# Altium project PCB_Project_2.PrjPcb
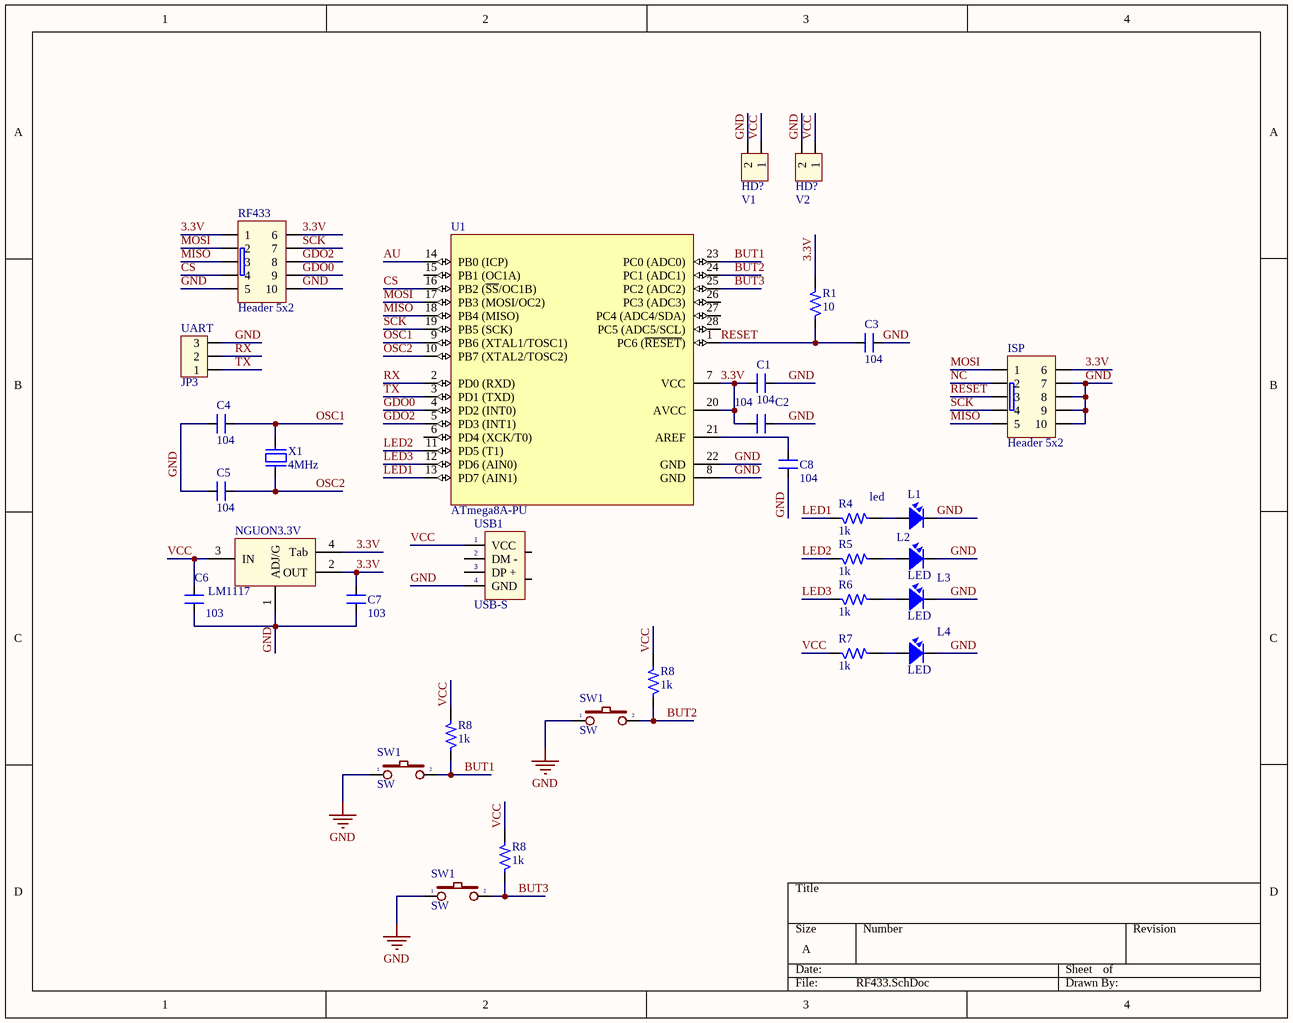
[diagram p0: RF433.SchDoc]
1 sheet, 32 parts. Net scope: global (net labels, ports and power ports of the same name join across sheets).
Board file: PCB1.PcbDoc

## Sheet RF433.SchDoc
size A

### Parts
(Parts that share a designator on the sheet are numbered #1, #2 ... from top to bottom, then left to right.)
C1  104  [SM-0805]
C2  104  [SM-0805]
C3  104  [SM-0805]
C4  104  [SM-0805]
C5  104  [SM-0805]
C6  103  [SM-0805]
C7  103  [SM-0805]
C8  104  [SM-0805]
HD?#1  V1  [HED2]
HD?#2  V2  [HED2]
ISP  Header 5x2  [HED2X5_cen]
L1  led  [LED-3]
L2  LED  [LED-3]
L3  LED  [LED-3]
L4  LED  [LED-3]
NGUON3.3V  LM1117  [SOT223-4N]
R1  10  [R1/2W]
R4  1k  [SM-0805]
R5  1k  [SM-0805]
R6  1k  [SM-0805]
R7  1k  [SM-0805]
R8#1  1k  [R1/4W]
R8#2  1k  [R1/4W]
R8#3  1k  [R1/4W]
RF433  Header 5x2  [HED2X5_cen]
SW1#1  SW  [SW2]
SW1#2  SW  [SW2]
SW1#3  SW  [SW2]
U1  ATmega8A-PU  [28P3]
UART  JP3  [CON3]
USB1  USB-S  [USB-A]
X1  4MHz  [XT2]

### Nets
GND: C1.1 C2.2 C3.1 C4.2 C5.2 C6.1 C7.1 C8.1 HD?#1.2 HD?#2.2 ISP.7 ISP.8 ISP.9 ISP.10 L1.2 L2.2 L3.2 L4.2 NGUON3.3V.1(ADJ/G) RF433.5 RF433.10 SW1#1.1 SW1#2.1 SW1#3.1 U1.8(GND) U1.22(GND) UART.3 USB1.4(GND)
3.3V: C1.2 C2.1 C7.2 ISP.6 NGUON3.3V.2(OUT) NGUON3.3V.4(Tab) R1.2 RF433.1 RF433.6 U1.7(VCC) U1.20(AVCC)
AU: U1.14(PB0_(ICP))
BUT1: R8#2.1 SW1#2.2 U1.23(PC0_(ADC0))
BUT2: R8#1.1 SW1#1.2 U1.24(PC1_(ADC1))
BUT3: R8#3.1 SW1#3.2 U1.25(PC2_(ADC2))
CS: RF433.4 U1.16(PB2_(~{SS}/OC1B))
GDO0: RF433.9 U1.4(PD2_(INT0))
GDO2: RF433.8 U1.5(PD3_(INT1))
LED1: R4.1 U1.13(PD7_(AIN1))
LED2: R5.1 U1.11(PD5_(T1))
LED3: R6.1 U1.12(PD6_(AIN0))
MISO: ISP.5 RF433.3 U1.18(PB4_(MISO))
MOSI: ISP.1 RF433.2 U1.17(PB3_(MOSI/OC2))
NC: ISP.2
OSC1: C4.1 U1.9(PB6_(XTAL1/TOSC1)) X1.2
OSC2: C5.1 U1.10(PB7_(XTAL2/TOSC2)) X1.1
RESET: C3.2 ISP.3 R1.1 U1.1(PC6_(~{RESET}))
RX: U1.2(PD0_(RXD)) UART.2
SCK: ISP.4 RF433.7 U1.19(PB5_(SCK))
TX: U1.3(PD1_(TXD)) UART.1
VCC: C6.2 HD?#1.1 HD?#2.1 NGUON3.3V.3(IN) R7.1 R8#1.2 R8#2.2 R8#3.2 USB1.1(VCC)
NetC8_2: C8.2 U1.21(AREF)
NetL1_1: L1.1 R4.2
NetL2_1: L2.1 R5.2
NetL3_1: L3.1 R6.2
NetL4_1: L4.1 R7.2

Not connected (* = marked no-connect by the designer): U1 6(PD4_(XCK/T0)) 15(PB1_(OC1A)) 26(PC3_(ADC3)) 27(PC4_(ADC4/SDA)) 28(PC5_(ADC5/SCL)); USB1 2(DM_-) 3(DP_+) 5 6

### Library data of the parts
C1-C5 C8 = CM: Cap SMD; Value: 103
C6 C7 = CM: Cap SMD; Value: 103
HD?#1 HD?#2 = Hed2: Header 2 (Green); Value: Header 2
ISP RF433 = HED5x2: Value: Header 5x2
L1-L4 = LED: LED Single colour Green and Red; Value: LED 3 ly Single Colour
NGUON3.3V = LM1117: 3v3; Value: LM317
R1 R4-R7 R8#1-R8#3 = R: Resistor 1/4W; Value: R1/4W - 1K
SW1#1-SW1#3 = SW2: Switch button 2 pin; Value: SW chip 2 pin
U1 = ATmega8A-PU: 8-bit AVR Microcontroller, 8KB Flash, 512 Bytes EEPROM, 1KB SRAM, 28-pin PDIP, Industrial Grade (-40°C to 85°C); Published: 1-Apr-2010; DatasheetVersion: revC, Jul-2009; PackageVersion: revB, Sep-2001; PackageReference: 28P3; Publisher: Altium Limited; PackageDescription: 28-lead (0.300"/7.62mm Wide) Plastic Dual Inline Package (PDIP); Supplier 1: Digi-Key; Supplier Part Number 1: ATMEGA8A-PU-ND; Supplier 2: Farnell; Supplier Part Number 2: 1748534; Supplier 3: Mouser; Supplier Part Number 3: 556-ATMEGA8A-PU; ComponentLink1Description: Manufacturer Link; ComponentLink1URL: http://www.atmel.com/products/avr/default.asp?; ComponentLink2Description: ATmega8A Datasheet; ComponentLink2URL: http://www.atmel.com/dyn/resources/prod_documents/doc8159.pdf; ComponentLink3Description: ATmega8A Summary; ComponentLink3URL: http://www.atmel.com/dyn/resources/prod_documents/8159S.pdf; ComponentLink4Description: Atmel.com Home; ComponentLink4URL: http://www.atmel.com
UART = Con3: Connector 3; Value: Connector 3
USB1 = USB_S: USB connector; Value: USB
X1 = XT2: Crystal For all Crystal 2pin.; Value: 4Mhz